# EAGLE design p8x-alu-card (EAGLE 9.6.2)
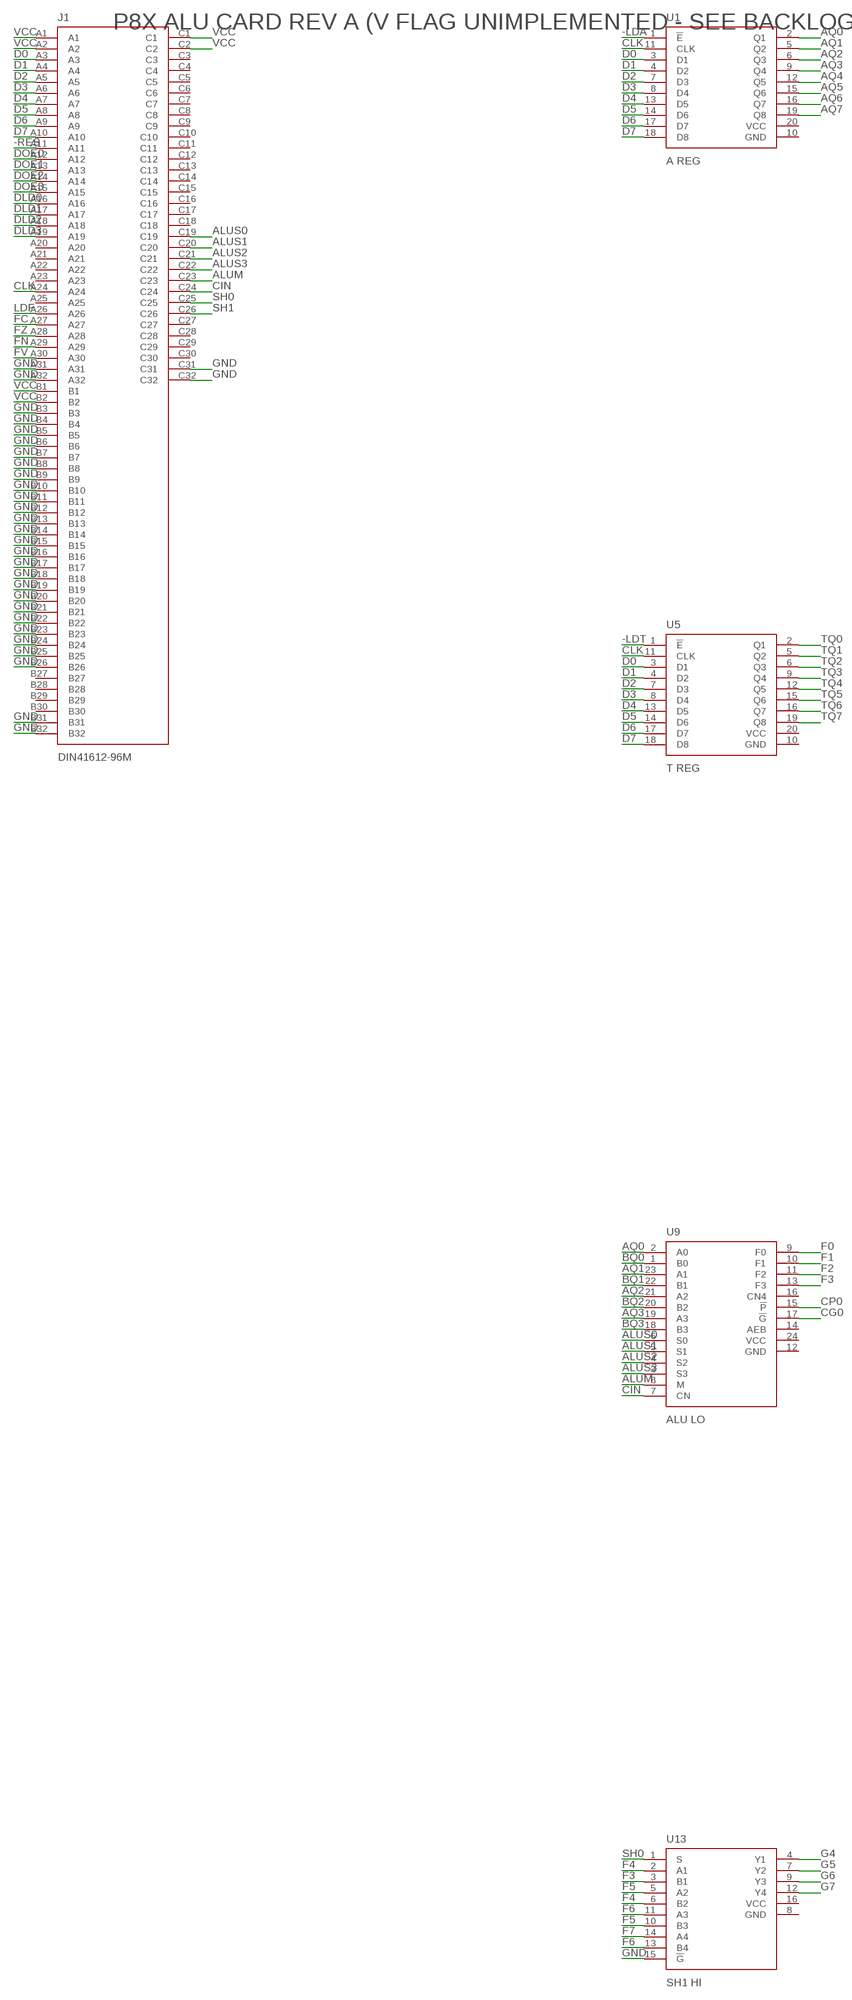
[diagram p0: schematic, sheet 1, part 1 of 3]
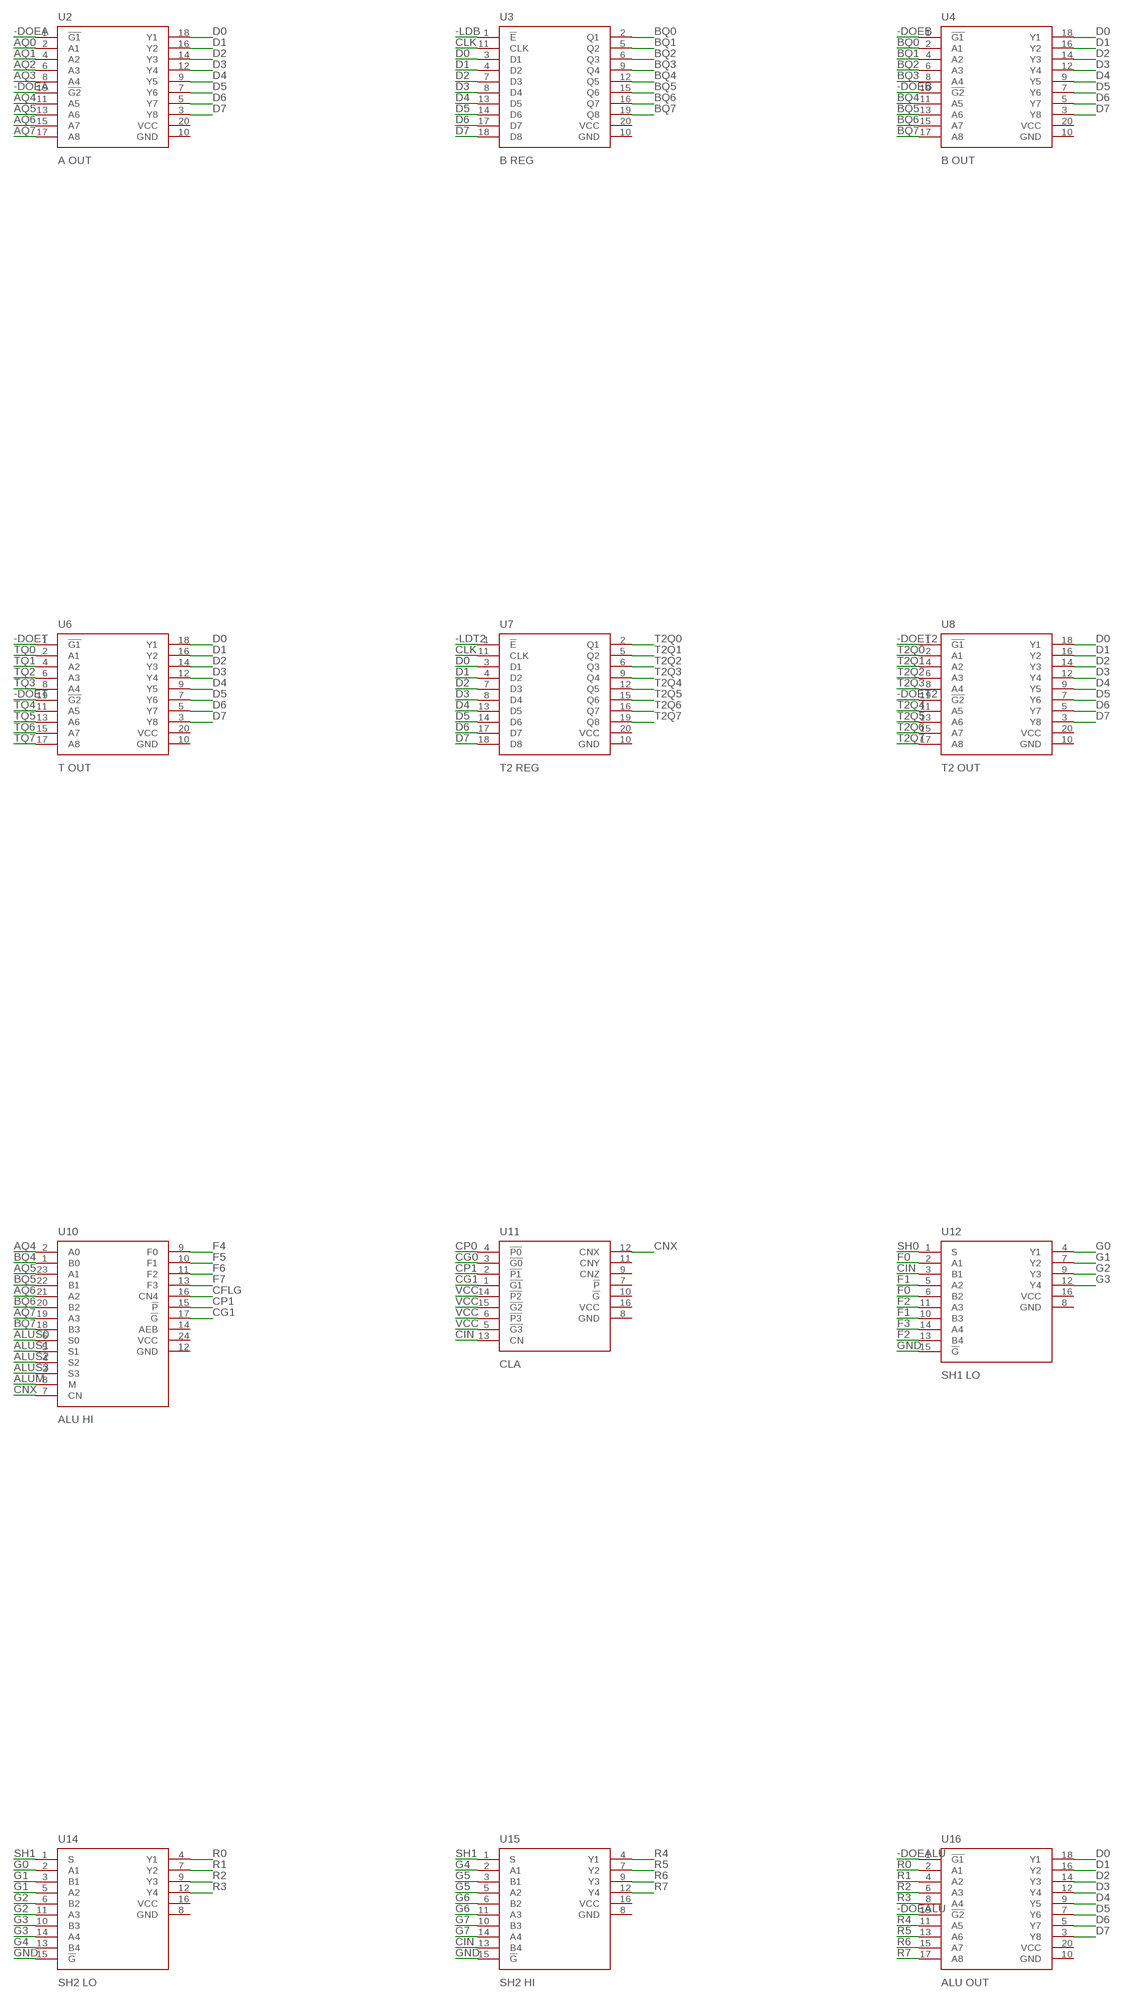
[diagram p1: schematic, sheet 1, part 2 of 3]
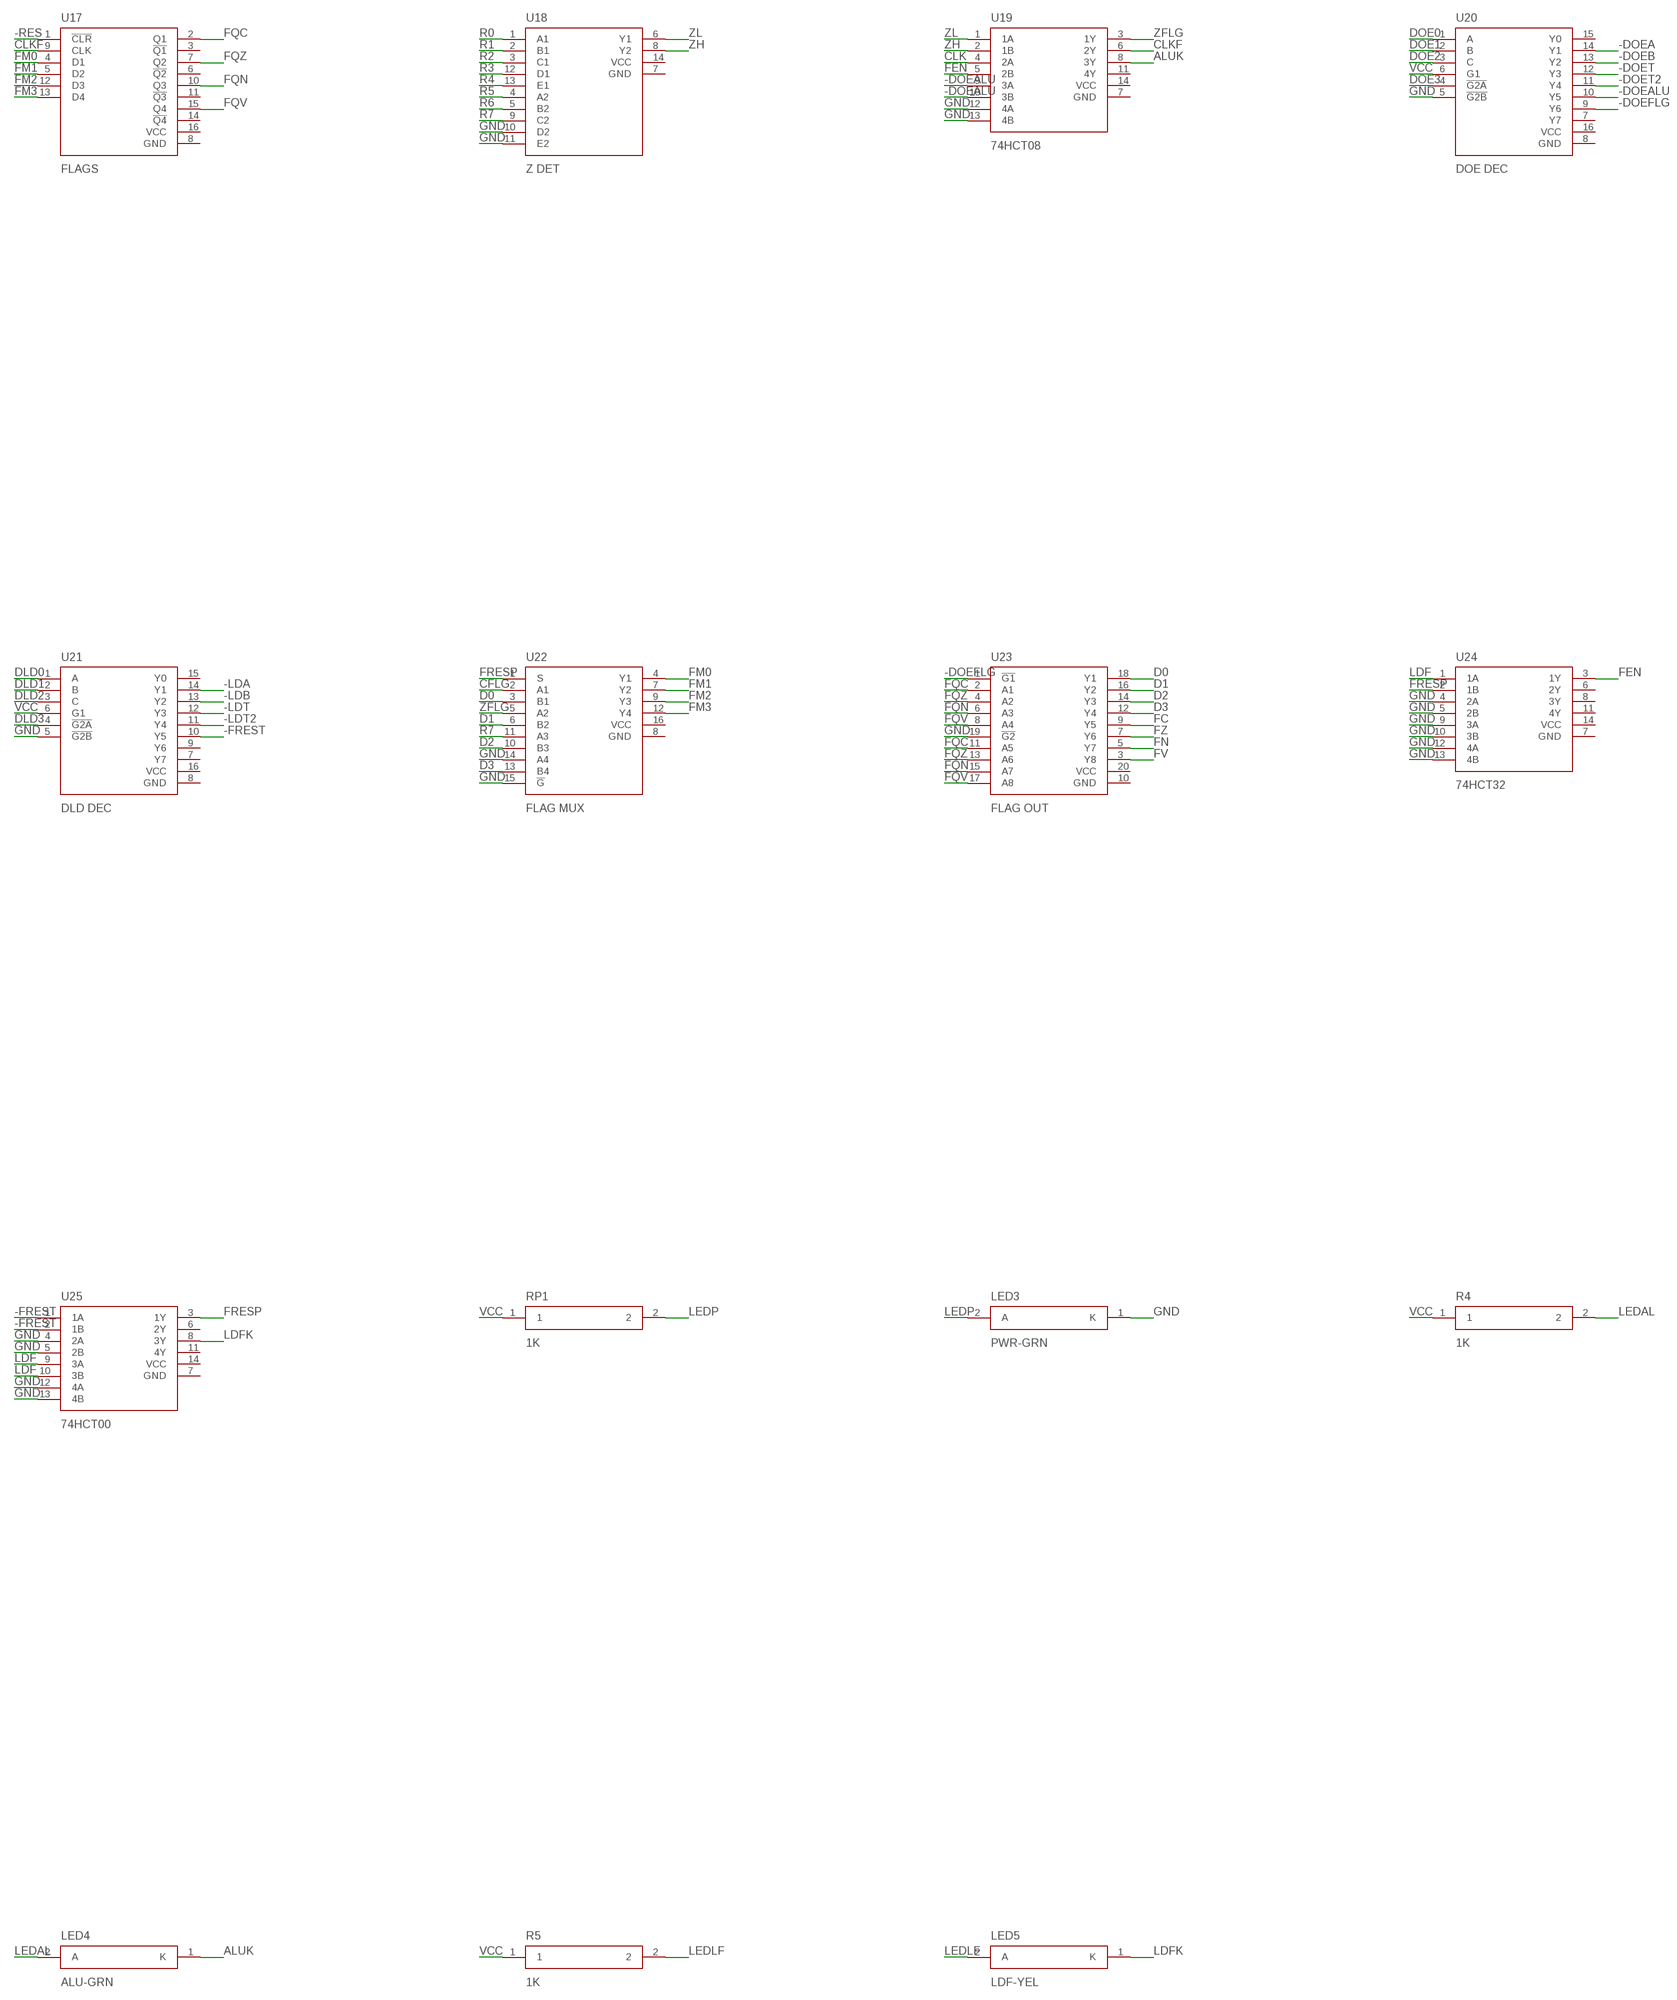
[diagram p2: schematic, sheet 1, part 3 of 3]

## Parts
J1  DIN41612-96M  DIN96  [DIN96]
LED3  PWR-GRN  LED  [LED5]
LED4  ALU-GRN  LED  [LED5]
LED5  LDF-YEL  LED  [LED5]
R4  1K  RES  [R_AXIAL]
R5  1K  RES  [R_AXIAL]
RP1  1K  RES  [R_AXIAL]
U1  A REG  74377V2  [DIP20]
U2  A OUT  74244  [DIP20]
U3  B REG  74377V2  [DIP20]
U4  B OUT  74244  [DIP20]
U5  T REG  74377V2  [DIP20]
U6  T OUT  74244  [DIP20]
U7  T2 REG  74377V2  [DIP20]
U8  T2 OUT  74244  [DIP20]
U9  ALU LO  74181  [DIP24W]
U10  ALU HI  74181  [DIP24W]
U11  CLA  74182  [DIP16]
U12  SH1 LO  74157  [DIP16]
U13  SH1 HI  74157  [DIP16]
U14  SH2 LO  74157  [DIP16]
U15  SH2 HI  74157  [DIP16]
U16  ALU OUT  74244  [DIP20]
U17  FLAGS  74175  [DIP16]
U18  Z DET  74260  [DIP14]
U19  74HCT08  GATES14  [DIP14]
U20  DOE DEC  74138  [DIP16]
U21  DLD DEC  74138  [DIP16]
U22  FLAG MUX  74157  [DIP16]
U23  FLAG OUT  74244  [DIP20]
U24  74HCT32  GATES14  [DIP14]
U25  74HCT00  GATES14  [DIP14]

## Nets
-DOEA: U2.1(!G1) U2.19(!G2) U20.14(Y1)
-DOEALU: U16.1(!G1) U16.19(!G2) U19.9(3A) U19.10(3B) U20.10(Y5)
-DOEB: U4.1(!G1) U4.19(!G2) U20.13(Y2)
-DOEFLG: U20.9(Y6) U23.1(!G1)
-DOET: U6.1(!G1) U6.19(!G2) U20.12(Y3)
-DOET2: U8.1(!G1) U8.19(!G2) U20.11(Y4)
-FREST: U21.10(Y5) U25.1(1A) U25.2(1B)
-LDA: U1.1(!E) U21.14(Y1)
-LDB: U3.1(!E) U21.13(Y2)
-LDT: U5.1(!E) U21.12(Y3)
-LDT2: U7.1(!E) U21.11(Y4)
-RES: J1.A11 U17.1(!CLR)
ALUK: LED4.1(K) U19.8(3Y)
ALUM: J1.C23 U9.8(M) U10.8(M)
ALUS0: J1.C19 U9.6(S0) U10.6(S0)
ALUS1: J1.C20 U9.5(S1) U10.5(S1)
ALUS2: J1.C21 U9.4(S2) U10.4(S2)
ALUS3: J1.C22 U9.3(S3) U10.3(S3)
AQ0: U1.2(Q1) U2.2(A1) U9.2(A0)
AQ1: U1.5(Q2) U2.4(A2) U9.23(A1)
AQ2: U1.6(Q3) U2.6(A3) U9.21(A2)
AQ3: U1.9(Q4) U2.8(A4) U9.19(A3)
AQ4: U1.12(Q5) U2.11(A5) U10.2(A0)
AQ5: U1.15(Q6) U2.13(A6) U10.23(A1)
AQ6: U1.16(Q7) U2.15(A7) U10.21(A2)
AQ7: U1.19(Q8) U2.17(A8) U10.19(A3)
BQ0: U3.2(Q1) U4.2(A1) U9.1(B0)
BQ1: U3.5(Q2) U4.4(A2) U9.22(B1)
BQ2: U3.6(Q3) U4.6(A3) U9.20(B2)
BQ3: U3.9(Q4) U4.8(A4) U9.18(B3)
BQ4: U3.12(Q5) U4.11(A5) U10.1(B0)
BQ5: U3.15(Q6) U4.13(A6) U10.22(B1)
BQ6: U3.16(Q7) U4.15(A7) U10.20(B2)
BQ7: U3.19(Q8) U4.17(A8) U10.18(B3)
CFLG: U10.16(CN4) U22.2(A1)
CG0: U9.17(!G) U11.3(!G0)
CG1: U10.17(!G) U11.1(!G1)
CIN: J1.C24 U9.7(CN) U11.13(CN) U12.3(B1) U15.13(B4)
CLK: J1.A24 U1.11(CLK) U3.11(CLK) U5.11(CLK) U7.11(CLK) U19.4(2A)
CLKF: U17.9(CLK) U19.6(2Y)
CNX: U10.7(CN) U11.12(CNX)
CP0: U9.15(!P) U11.4(!P0)
CP1: U10.15(!P) U11.2(!P1)
D0: J1.A3 U1.3(D1) U2.18(Y1) U3.3(D1) U4.18(Y1) U5.3(D1) U6.18(Y1) U7.3(D1) U8.18(Y1) U16.18(Y1) U22.3(B1) U23.18(Y1)
D1: J1.A4 U1.4(D2) U2.16(Y2) U3.4(D2) U4.16(Y2) U5.4(D2) U6.16(Y2) U7.4(D2) U8.16(Y2) U16.16(Y2) U22.6(B2) U23.16(Y2)
D2: J1.A5 U1.7(D3) U2.14(Y3) U3.7(D3) U4.14(Y3) U5.7(D3) U6.14(Y3) U7.7(D3) U8.14(Y3) U16.14(Y3) U22.10(B3) U23.14(Y3)
D3: J1.A6 U1.8(D4) U2.12(Y4) U3.8(D4) U4.12(Y4) U5.8(D4) U6.12(Y4) U7.8(D4) U8.12(Y4) U16.12(Y4) U22.13(B4) U23.12(Y4)
D4: J1.A7 U1.13(D5) U2.9(Y5) U3.13(D5) U4.9(Y5) U5.13(D5) U6.9(Y5) U7.13(D5) U8.9(Y5) U16.9(Y5)
D5: J1.A8 U1.14(D6) U2.7(Y6) U3.14(D6) U4.7(Y6) U5.14(D6) U6.7(Y6) U7.14(D6) U8.7(Y6) U16.7(Y6)
D6: J1.A9 U1.17(D7) U2.5(Y7) U3.17(D7) U4.5(Y7) U5.17(D7) U6.5(Y7) U7.17(D7) U8.5(Y7) U16.5(Y7)
D7: J1.A10 U1.18(D8) U2.3(Y8) U3.18(D8) U4.3(Y8) U5.18(D8) U6.3(Y8) U7.18(D8) U8.3(Y8) U16.3(Y8)
DLD0: J1.A16 U21.1(A)
DLD1: J1.A17 U21.2(B)
DLD2: J1.A18 U21.3(C)
DLD3: J1.A19 U21.4(!G2A)
DOE0: J1.A12 U20.1(A)
DOE1: J1.A13 U20.2(B)
DOE2: J1.A14 U20.3(C)
DOE3: J1.A15 U20.4(!G2A)
F0: U9.9(F0) U12.2(A1) U12.6(B2)
F1: U9.10(F1) U12.5(A2) U12.10(B3)
F2: U9.11(F2) U12.11(A3) U12.13(B4)
F3: U9.13(F3) U12.14(A4) U13.3(B1)
F4: U10.9(F0) U13.2(A1) U13.6(B2)
F5: U10.10(F1) U13.5(A2) U13.10(B3)
F6: U10.11(F2) U13.11(A3) U13.13(B4)
F7: U10.13(F3) U13.14(A4)
FC: J1.A27 U23.9(Y5)
FEN: U19.5(2B) U24.3(1Y)
FM0: U17.4(D1) U22.4(Y1)
FM1: U17.5(D2) U22.7(Y2)
FM2: U17.12(D3) U22.9(Y3)
FM3: U17.13(D4) U22.12(Y4)
FN: J1.A29 U23.5(Y7)
FQC: U17.2(Q1) U23.2(A1) U23.11(A5)
FQN: U17.10(Q3) U23.6(A3) U23.15(A7)
FQV: U17.15(Q4) U23.8(A4) U23.17(A8)
FQZ: U17.7(Q2) U23.4(A2) U23.13(A6)
FRESP: U22.1(S) U24.2(1B) U25.3(1Y)
FV: J1.A30 U23.3(Y8)
FZ: J1.A28 U23.7(Y6)
G0: U12.4(Y1) U14.2(A1)
G1: U12.7(Y2) U14.3(B1) U14.5(A2)
G2: U12.9(Y3) U14.6(B2) U14.11(A3)
G3: U12.12(Y4) U14.10(B3) U14.14(A4)
G4: U13.4(Y1) U14.13(B4) U15.2(A1)
G5: U13.7(Y2) U15.3(B1) U15.5(A2)
G6: U13.9(Y3) U15.6(B2) U15.11(A3)
G7: U13.12(Y4) U15.10(B3) U15.14(A4)
GND: J1.A31 J1.A32 J1.B3 J1.B4 J1.B5 J1.B6 J1.B7 J1.B8 J1.B9 J1.B10 J1.B11 J1.B12 J1.B13 J1.B14 J1.B15 J1.B16 J1.B17 J1.B18 J1.B19 J1.B20 J1.B21 J1.B22 J1.B23 J1.B24 J1.B25 J1.B26 J1.B31 J1.B32 J1.C31 J1.C32 LED3.1(K) U12.15(!G) U13.15(!G) U14.15(!G) U15.15(!G) U18.10(D2) U18.11(E2) U19.12(4A) U19.13(4B) U20.5(!G2B) U21.5(!G2B) U22.14(A4) U22.15(!G) U23.19(!G2) U24.4(2A) U24.5(2B) U24.9(3A) U24.10(3B) U24.12(4A) U24.13(4B) U25.4(2A) U25.5(2B) U25.12(4A) U25.13(4B)
LDF: J1.A26 U24.1(1A) U25.9(3A) U25.10(3B)
LDFK: LED5.1(K) U25.8(3Y)
LEDAL: LED4.2(A) R4.2
LEDLF: LED5.2(A) R5.2
LEDP: LED3.2(A) RP1.2
R0: U14.4(Y1) U16.2(A1) U18.1(A1)
R1: U14.7(Y2) U16.4(A2) U18.2(B1)
R2: U14.9(Y3) U16.6(A3) U18.3(C1)
R3: U14.12(Y4) U16.8(A4) U18.12(D1)
R4: U15.4(Y1) U16.11(A5) U18.13(E1)
R5: U15.7(Y2) U16.13(A6) U18.4(A2)
R6: U15.9(Y3) U16.15(A7) U18.5(B2)
R7: U15.12(Y4) U16.17(A8) U18.9(C2) U22.11(A3)
SH0: J1.C25 U12.1(S) U13.1(S)
SH1: J1.C26 U14.1(S) U15.1(S)
T2Q0: U7.2(Q1) U8.2(A1)
T2Q1: U7.5(Q2) U8.4(A2)
T2Q2: U7.6(Q3) U8.6(A3)
T2Q3: U7.9(Q4) U8.8(A4)
T2Q4: U7.12(Q5) U8.11(A5)
T2Q5: U7.15(Q6) U8.13(A6)
T2Q6: U7.16(Q7) U8.15(A7)
T2Q7: U7.19(Q8) U8.17(A8)
TQ0: U5.2(Q1) U6.2(A1)
TQ1: U5.5(Q2) U6.4(A2)
TQ2: U5.6(Q3) U6.6(A3)
TQ3: U5.9(Q4) U6.8(A4)
TQ4: U5.12(Q5) U6.11(A5)
TQ5: U5.15(Q6) U6.13(A6)
TQ6: U5.16(Q7) U6.15(A7)
TQ7: U5.19(Q8) U6.17(A8)
VCC: J1.A1 J1.A2 J1.B1 J1.B2 J1.C1 J1.C2 R4.1 R5.1 RP1.1 U11.5(!G3) U11.6(!P3) U11.14(!P2) U11.15(!G2) U20.6(G1) U21.6(G1)
ZFLG: U19.3(1Y) U22.5(A2)
ZH: U18.8(Y2) U19.2(1B)
ZL: U18.6(Y1) U19.1(1A)
Unconnected: J1.A20 J1.A21 J1.A22 J1.A23 J1.A25 J1.B27 J1.B28 J1.B29 J1.B30 J1.C3 J1.C4 J1.C5 J1.C6 J1.C7 J1.C8 J1.C9 J1.C10 J1.C11 J1.C12 J1.C13 J1.C14 J1.C15 J1.C16 J1.C17 J1.C18 J1.C27 J1.C28 J1.C29 J1.C30 U1.10(GND) U1.20(VCC) U2.10(GND) U2.20(VCC) U3.10(GND) U3.20(VCC) U4.10(GND) U4.20(VCC) U5.10(GND) U5.20(VCC) U6.10(GND) U6.20(VCC) U7.10(GND) U7.20(VCC) U8.10(GND) U8.20(VCC) U9.12(GND) U9.14(AEB) U9.16(CN4) U9.24(VCC) U10.12(GND) U10.14(AEB) U10.24(VCC) U11.7(!P) U11.8(GND) U11.9(CNZ) U11.10(!G) U11.11(CNY) U11.16(VCC) U12.8(GND) U12.16(VCC) U13.8(GND) U13.16(VCC) U14.8(GND) U14.16(VCC) U15.8(GND) U15.16(VCC) U16.10(GND) U16.20(VCC) U17.3(!Q1) U17.6(!Q2) U17.8(GND) U17.11(!Q3) U17.14(!Q4) U17.16(VCC) U18.7(GND) U18.14(VCC) U19.7(GND) U19.11(4Y) U19.14(VCC) U20.7(Y7) U20.8(GND) U20.15(Y0) U20.16(VCC) U21.7(Y7) U21.8(GND) U21.9(Y6) U21.15(Y0) U21.16(VCC) U22.8(GND) U22.16(VCC) U23.10(GND) U23.20(VCC) U24.6(2Y) U24.7(GND) U24.8(3Y) U24.11(4Y) U24.14(VCC) U25.6(2Y) U25.7(GND) U25.11(4Y) U25.14(VCC)

## Notes on the sheet
- P8X ALU CARD REV A (V FLAG UNIMPLEMENTED - SEE BACKLOG)

## Library data of the parts
J1 = p8x:DIN96
LED3-LED5 = p8x:LED
R4 R5 RP1 = p8x:RES
U1 U3 U5 U7 = p8x:74377V2
U2 U4 U6 U8 U16 U23 = p8x:74244
U9 U10 = p8x:74181
U11 = p8x:74182
U12-U15 U22 = p8x:74157
U17 = p8x:74175
U18 = p8x:74260
U19 U24 U25 = p8x:GATES14
U20 U21 = p8x:74138

## Board
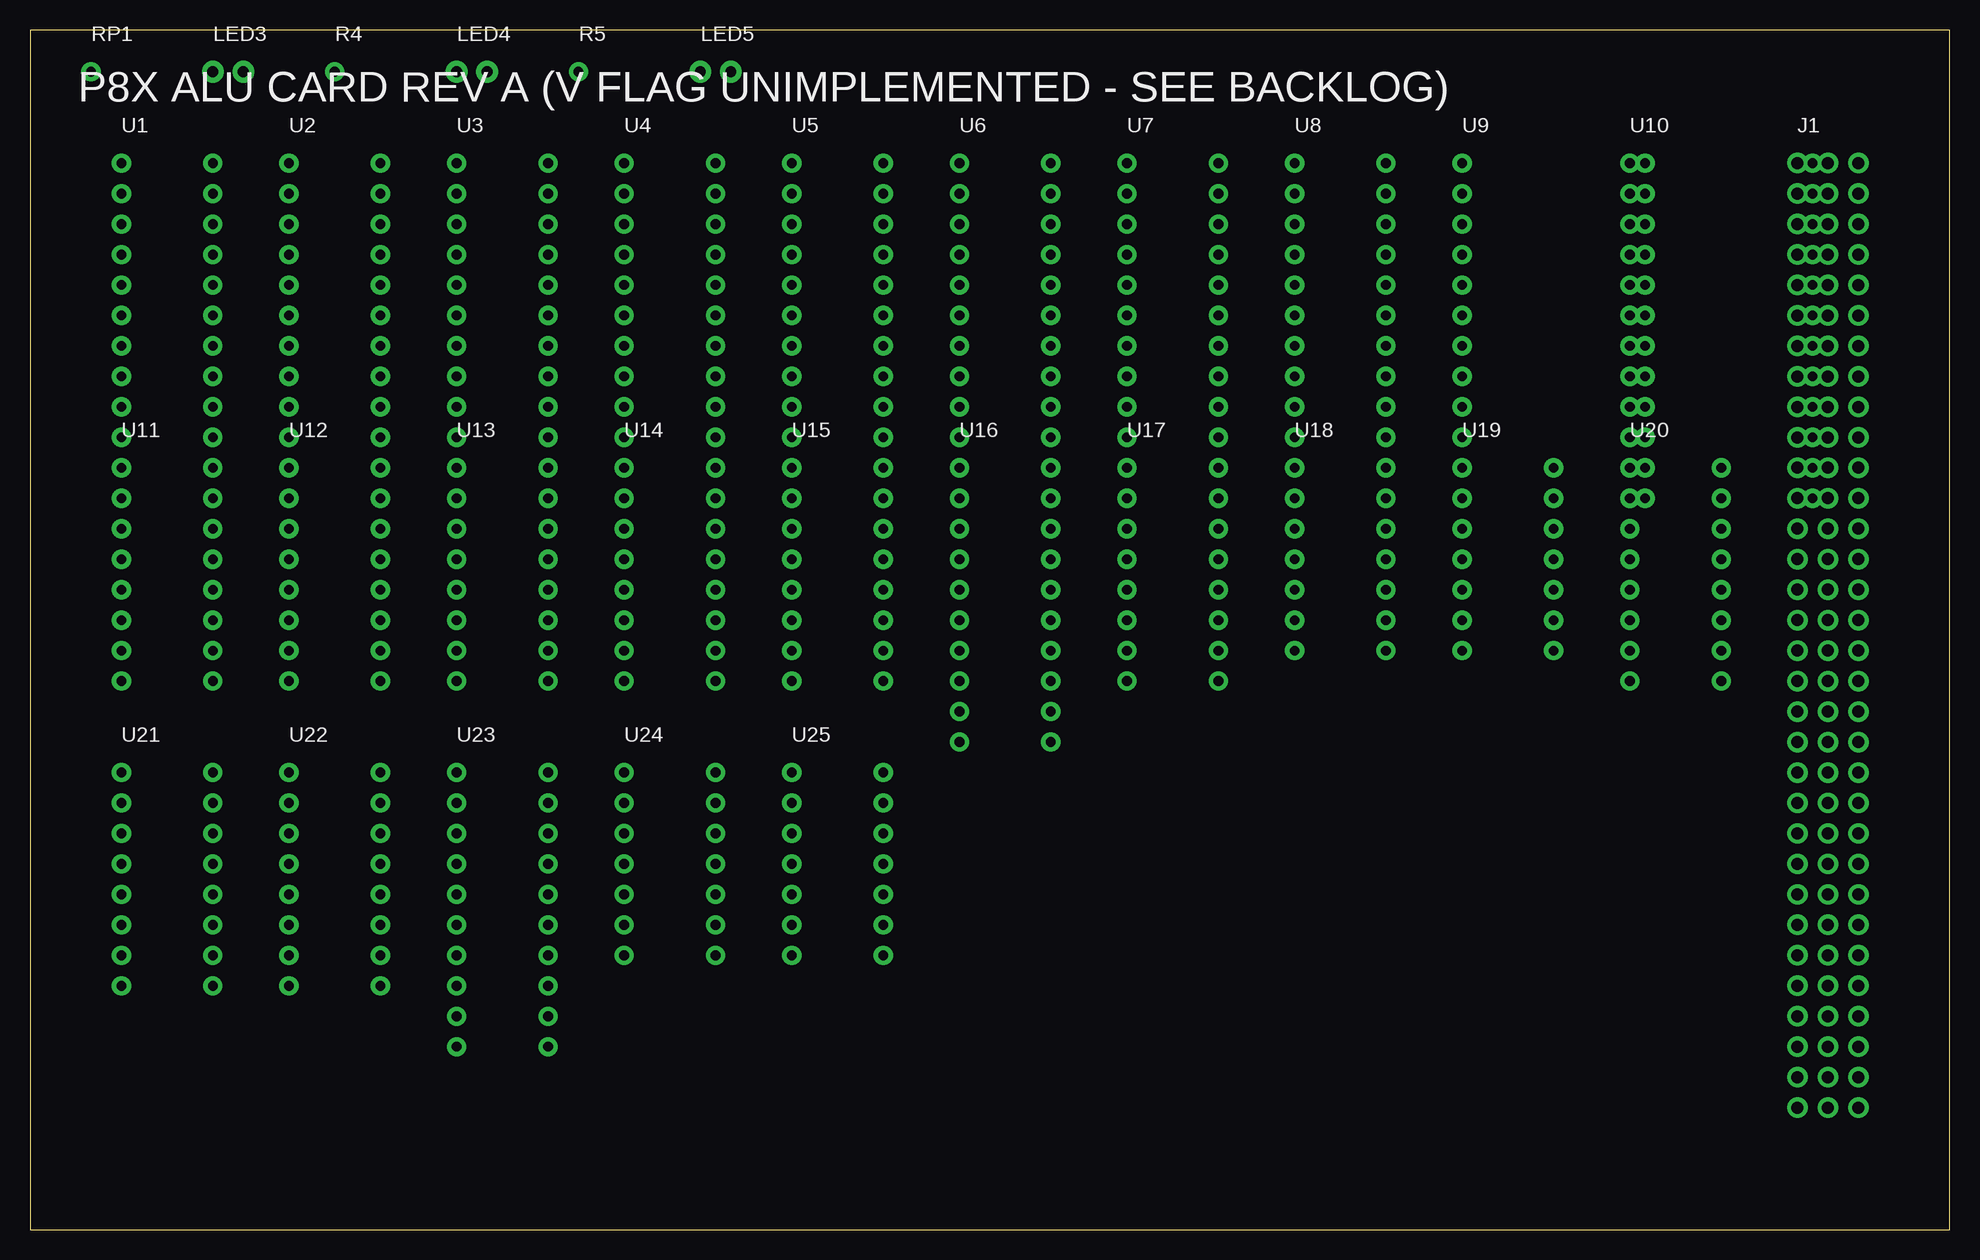
[diagram p3: board, top side]
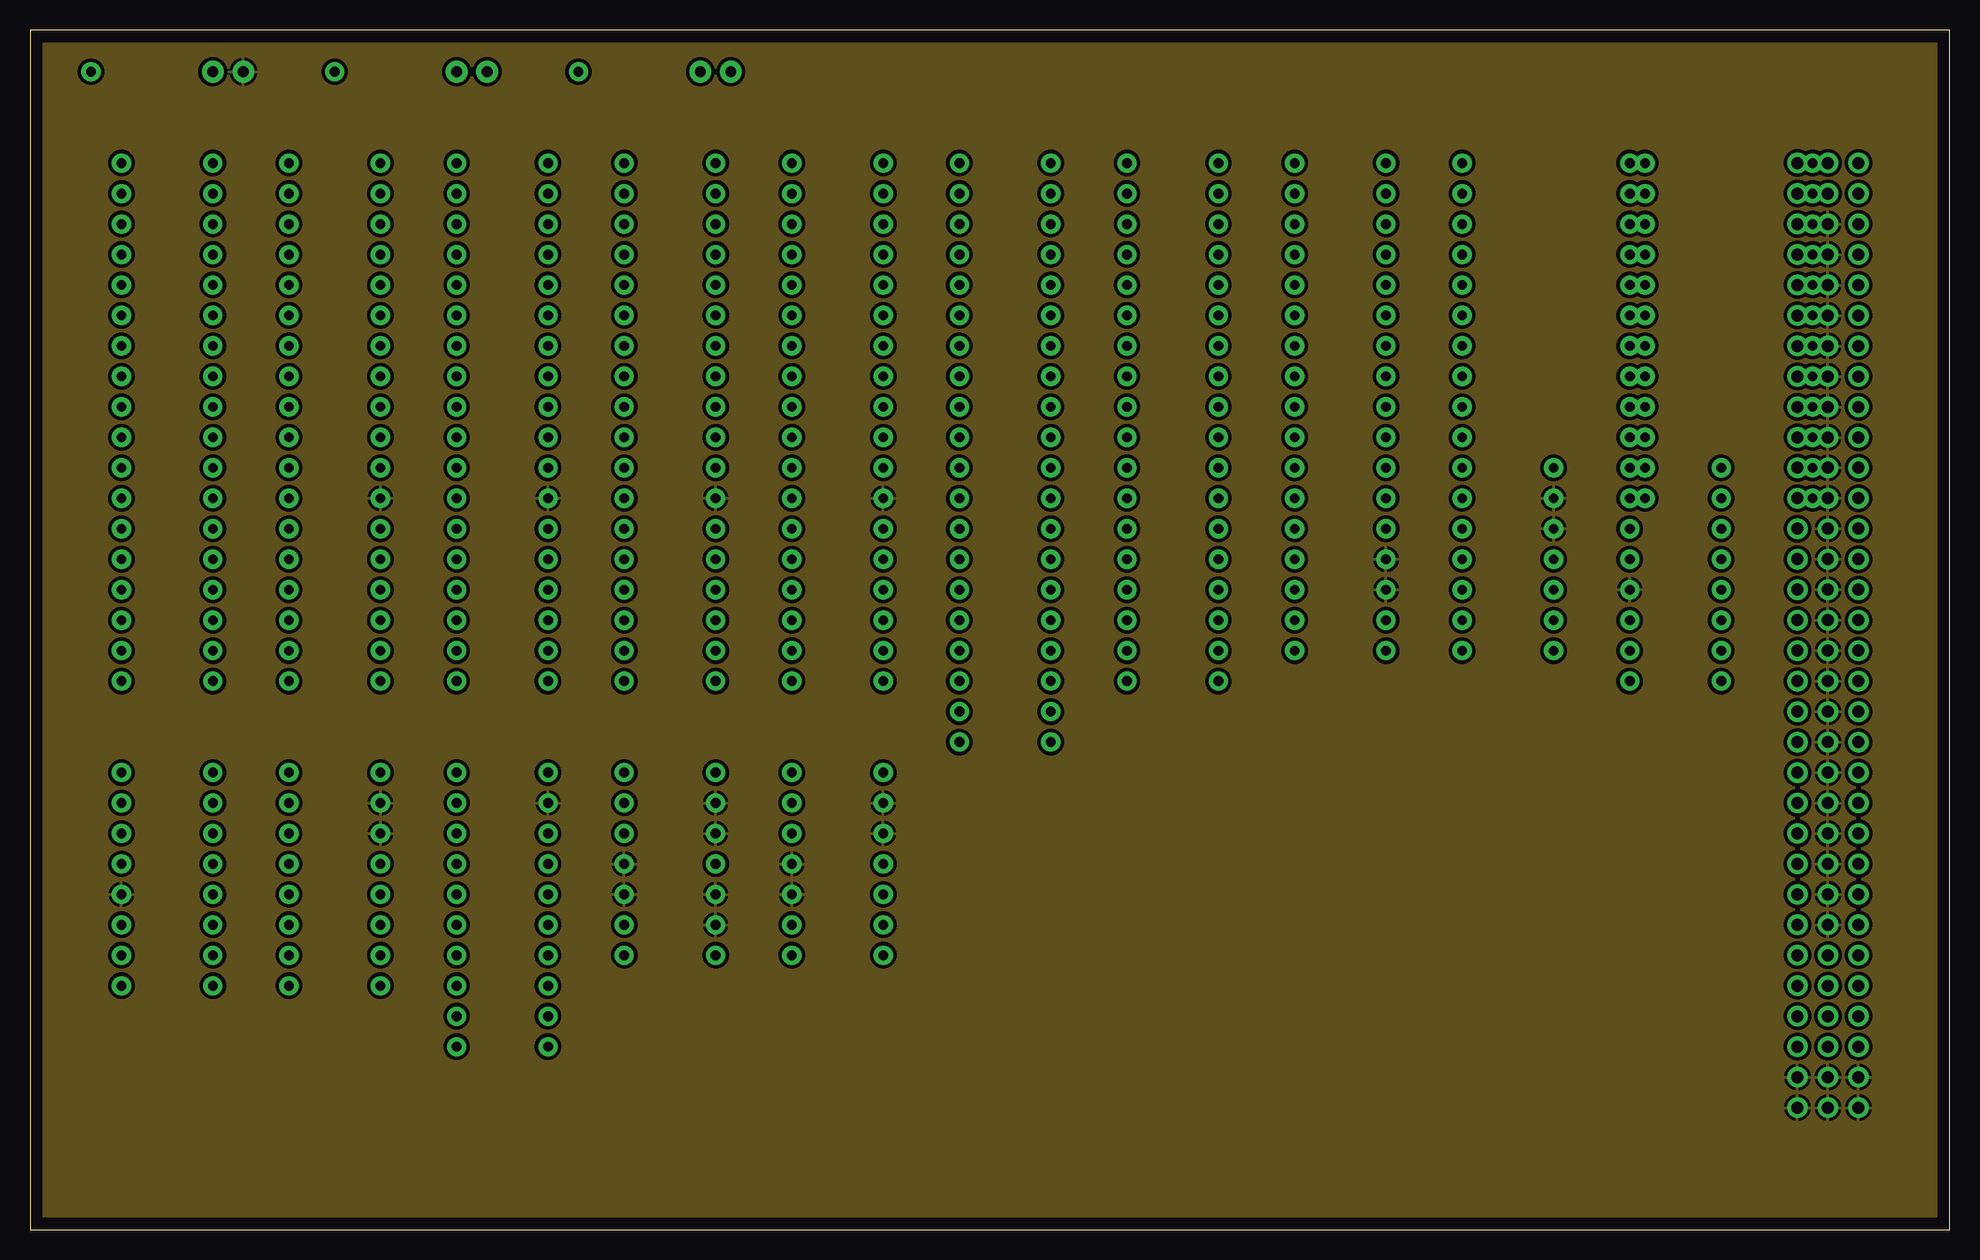
[diagram p4: board, inner layer Route2]
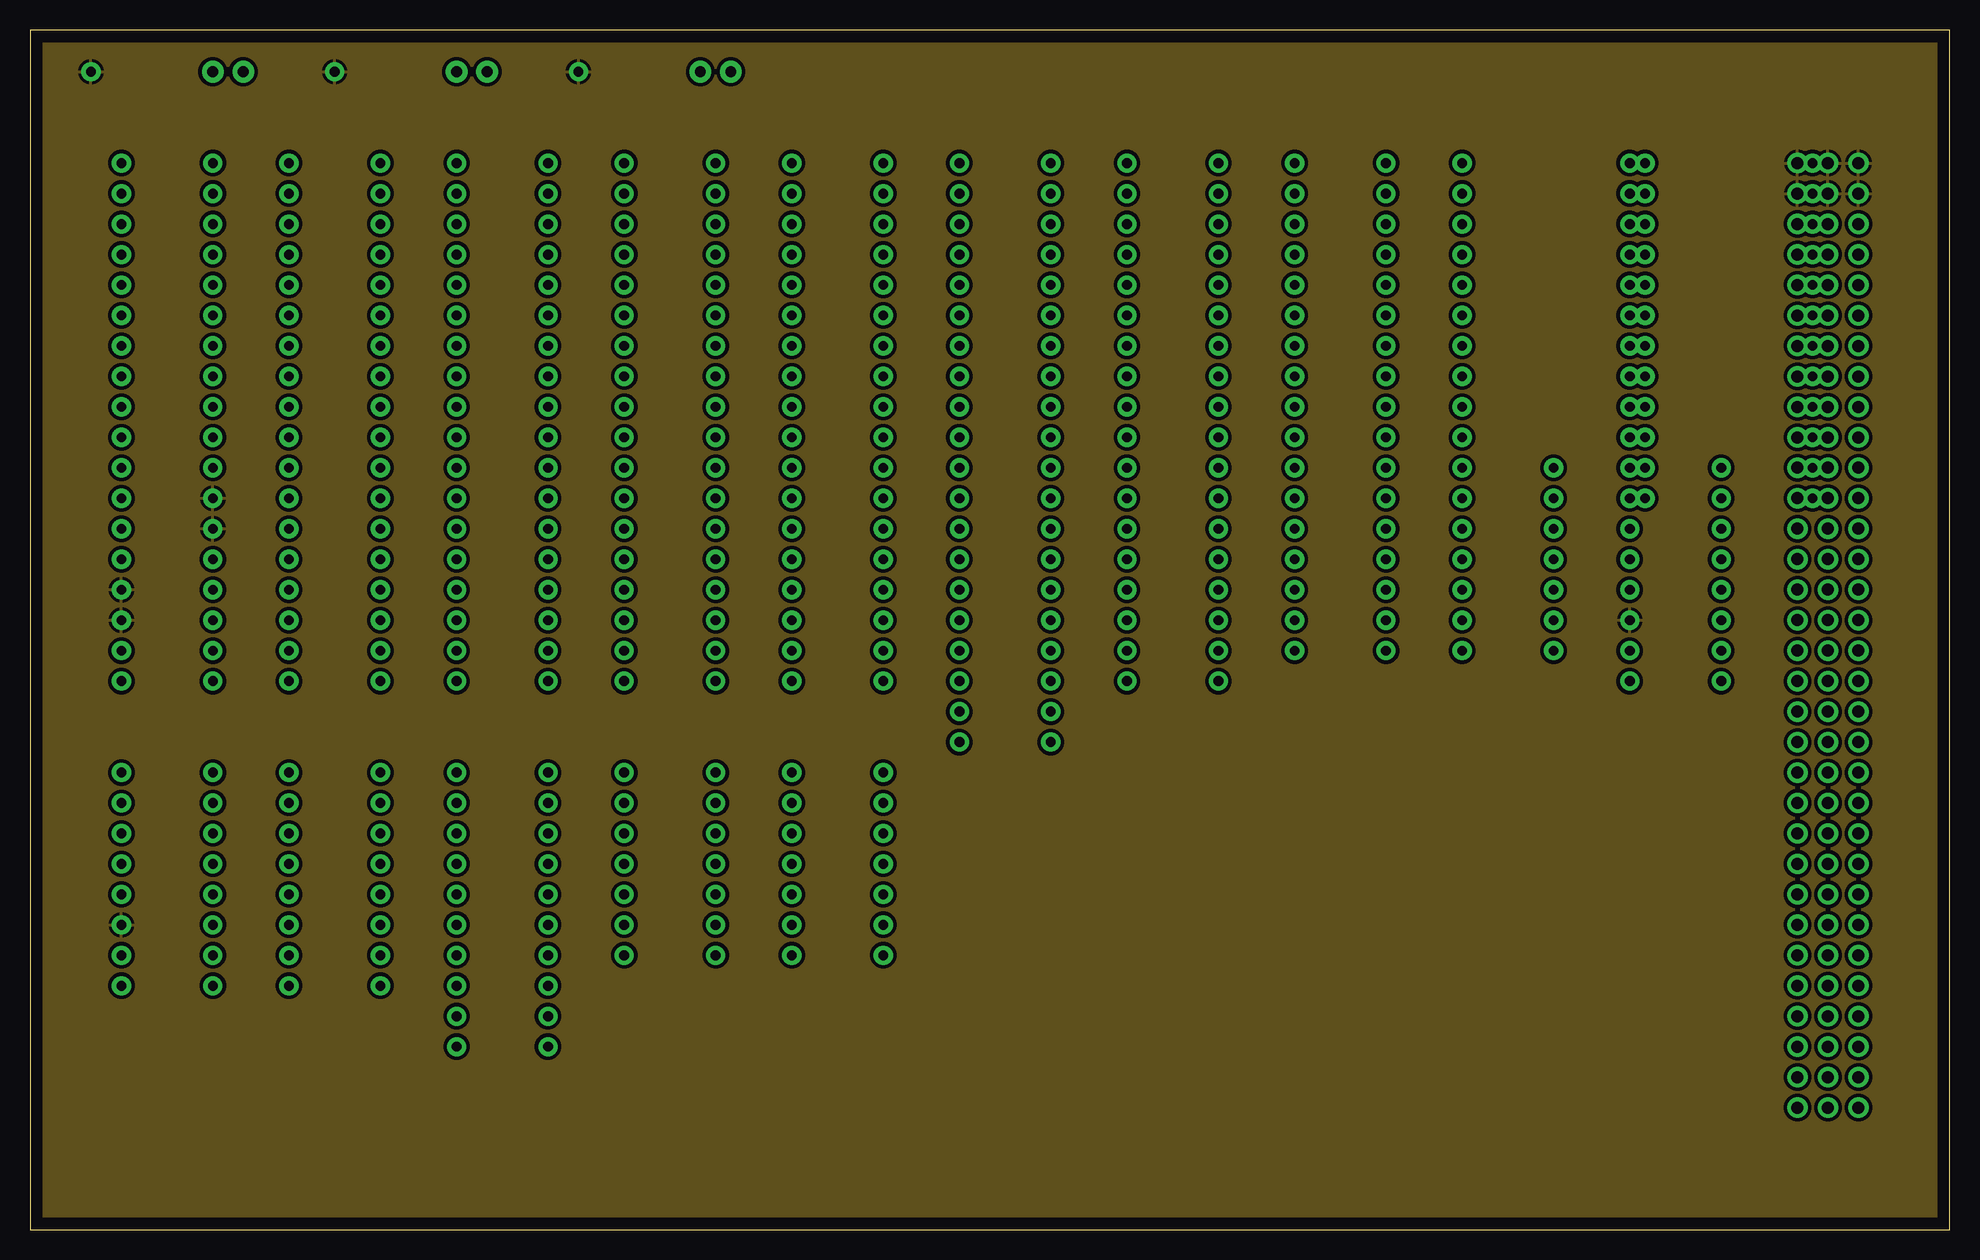
[diagram p5: board, inner layer Route15]

Size 160 x 100 mm. Coordinates in mm from the lower left corner, seen from the top.
Outline: 0,0 160,0 160,100 0,100 0,0
Copper layers (1*2*15*16): Top / Route2 / Route15 / Bottom

### Footprints (pad centres in the part's own frame; a part is rotated, then mirrored left to right if it is on the bottom)
DIN96 = drill 1 pad 1.7: A1 5.08,0; A2 5.08,-2.54; A3 5.08,-5.08; A4 5.08,-7.62; A5 5.08,-10.16; A6 5.08,-12.7; A7 5.08,-15.24; A8 5.08,-17.78; A9 5.08,-20.32; A10 5.08,-22.86; A11 5.08,-25.4; A12 5.08,-27.94; A13 5.08,-30.48; A14 5.08,-33.02; A15 5.08,-35.56; A16 5.08,-38.1; A17 5.08,-40.64; A18 5.08,-43.18; A19 5.08,-45.72; A20 5.08,-48.26; A21 5.08,-50.8; A22 5.08,-53.34; A23 5.08,-55.88; A24 5.08,-58.42; A25 5.08,-60.96; A26 5.08,-63.5; A27 5.08,-66.04; A28 5.08,-68.58; A29 5.08,-71.12; A30 5.08,-73.66; A31 5.08,-76.2; A32 5.08,-78.74; B1 2.54,0; B2 2.54,-2.54; B3 2.54,-5.08; B4 2.54,-7.62; B5 2.54,-10.16; B6 2.54,-12.7; B7 2.54,-15.24; B8 2.54,-17.78; B9 2.54,-20.32; B10 2.54,-22.86; B11 2.54,-25.4; B12 2.54,-27.94; B13 2.54,-30.48; B14 2.54,-33.02; B15 2.54,-35.56; B16 2.54,-38.1; B17 2.54,-40.64; B18 2.54,-43.18; B19 2.54,-45.72; B20 2.54,-48.26; B21 2.54,-50.8; B22 2.54,-53.34; B23 2.54,-55.88; B24 2.54,-58.42; B25 2.54,-60.96; B26 2.54,-63.5; B27 2.54,-66.04; B28 2.54,-68.58; B29 2.54,-71.12; B30 2.54,-73.66; B31 2.54,-76.2; B32 2.54,-78.74; C1 0,0; C2 0,-2.54; C3 0,-5.08; C4 0,-7.62; C5 0,-10.16; C6 0,-12.7; C7 0,-15.24; C8 0,-17.78; C9 0,-20.32; C10 0,-22.86; C11 0,-25.4; C12 0,-27.94; C13 0,-30.48; C14 0,-33.02; C15 0,-35.56; C16 0,-38.1; C17 0,-40.64; C18 0,-43.18; C19 0,-45.72; C20 0,-48.26; C21 0,-50.8; C22 0,-53.34; C23 0,-55.88; C24 0,-58.42; C25 0,-60.96; C26 0,-63.5; C27 0,-66.04; C28 0,-68.58; C29 0,-71.12; C30 0,-73.66; C31 0,-76.2; C32 0,-78.74
LED5 = drill 0.9 pad 1.8: 1 2.54,0; 2 0,0
R_AXIAL = drill 0.8 pad 1.6: 1 0,0; 2 10.16,0
DIP20 = drill 0.813 pad 1.6: 1 0,0; 2 0,-2.54; 3 0,-5.08; 4 0,-7.62; 5 0,-10.16; 6 0,-12.7; 7 0,-15.24; 8 0,-17.78; 9 0,-20.32; 10 0,-22.86; 11 7.62,-22.86; 12 7.62,-20.32; 13 7.62,-17.78; 14 7.62,-15.24; 15 7.62,-12.7; 16 7.62,-10.16; 17 7.62,-7.62; 18 7.62,-5.08; 19 7.62,-2.54; 20 7.62,0
DIP24W = drill 0.813 pad 1.6: 1 0,0; 2 0,-2.54; 3 0,-5.08; 4 0,-7.62; 5 0,-10.16; 6 0,-12.7; 7 0,-15.24; 8 0,-17.78; 9 0,-20.32; 10 0,-22.86; 11 0,-25.4; 12 0,-27.94; 13 15.24,-27.94; 14 15.24,-25.4; 15 15.24,-22.86; 16 15.24,-20.32; 17 15.24,-17.78; 18 15.24,-15.24; 19 15.24,-12.7; 20 15.24,-10.16; 21 15.24,-7.62; 22 15.24,-5.08; 23 15.24,-2.54; 24 15.24,0
DIP16 = drill 0.813 pad 1.6: 1 0,0; 2 0,-2.54; 3 0,-5.08; 4 0,-7.62; 5 0,-10.16; 6 0,-12.7; 7 0,-15.24; 8 0,-17.78; 9 7.62,-17.78; 10 7.62,-15.24; 11 7.62,-12.7; 12 7.62,-10.16; 13 7.62,-7.62; 14 7.62,-5.08; 15 7.62,-2.54; 16 7.62,0
DIP14 = drill 0.813 pad 1.6: 1 0,0; 2 0,-2.54; 3 0,-5.08; 4 0,-7.62; 5 0,-10.16; 6 0,-12.7; 7 0,-15.24; 8 7.62,-15.24; 9 7.62,-12.7; 10 7.62,-10.16; 11 7.62,-7.62; 12 7.62,-5.08; 13 7.62,-2.54; 14 7.62,0

### Placement (x,y rotation side)
J1  147.32,88.9 0 top
LED3  15.24,96.52 0 top
LED4  35.56,96.52 0 top
LED5  55.88,96.52 0 top
R4  25.4,96.52 0 top
R5  45.72,96.52 0 top
RP1  5.08,96.52 0 top
U1  7.62,88.9 0 top
U2  21.59,88.9 0 top
U3  35.56,88.9 0 top
U4  49.53,88.9 0 top
U5  63.5,88.9 0 top
U6  77.47,88.9 0 top
U7  91.44,88.9 0 top
U8  105.41,88.9 0 top
U9  119.38,88.9 0 top
U10  133.35,88.9 0 top
U11  7.62,63.5 0 top
U12  21.59,63.5 0 top
U13  35.56,63.5 0 top
U14  49.53,63.5 0 top
U15  63.5,63.5 0 top
U16  77.47,63.5 0 top
U17  91.44,63.5 0 top
U18  105.41,63.5 0 top
U19  119.38,63.5 0 top
U20  133.35,63.5 0 top
U21  7.62,38.1 0 top
U22  21.59,38.1 0 top
U23  35.56,38.1 0 top
U24  49.53,38.1 0 top
U25  63.5,38.1 0 top

### Tracks (layer width: path | path; a pad name or v marks a point on that pad's centre or on a via)
GND
  pour Route2 (isolate 0.3): 0,0 160,0 160,100 0,100
VCC
  pour Route15 (isolate 0.3): 0,0 160,0 160,100 0,100

### Text on the board
tPlace: P8X ALU CARD REV A (V FLAG UNIMPLEMENTED - SEE BACKLOG)